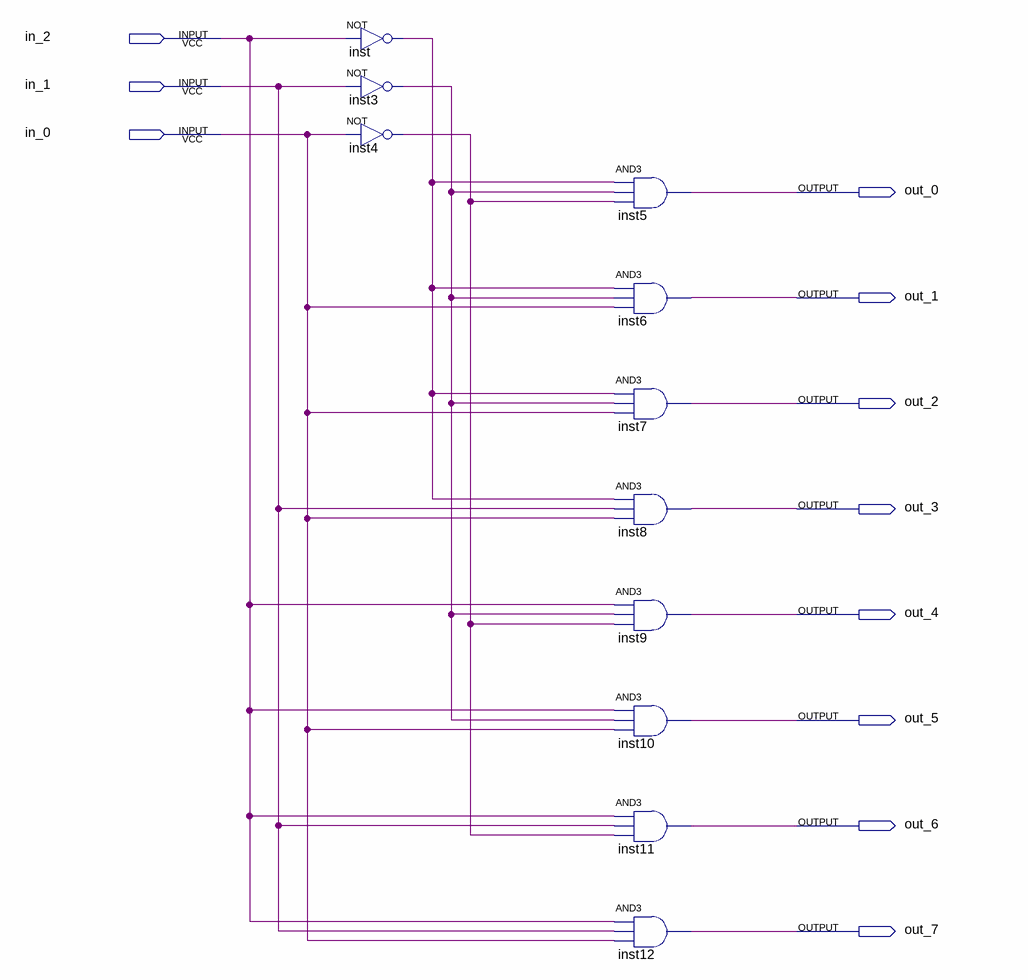
[diagram p0: schematic sheet]
// Quartus schematic dec3b.bdf as structural Verilog: 11 symbols, 11 pins
module dec3b (
  input  in_2,
  input  in_1,
  input  in_0,
  output out_0,
  output out_1,
  output out_2,
  output out_3,
  output out_4,
  output out_5,
  output out_6,
  output out_7
);

  wire inst3_out, inst4_out, inst_out;

  not inst (inst_out, in_2);
  not inst3 (inst3_out, in_1);
  not inst4 (inst4_out, in_0);
  and inst5 (out_0, inst_out, inst3_out, inst4_out);
  and inst6 (out_1, inst_out, inst3_out, in_0);
  and inst7 (out_2, inst_out, inst3_out, in_0);
  and inst8 (out_3, inst_out, in_1, in_0);
  and inst9 (out_4, in_2, inst3_out, inst4_out);
  and inst10 (out_5, in_2, inst3_out, in_0);
  and inst11 (out_6, in_2, in_1, inst4_out);
  and inst12 (out_7, in_2, in_1, in_0);
endmodule
